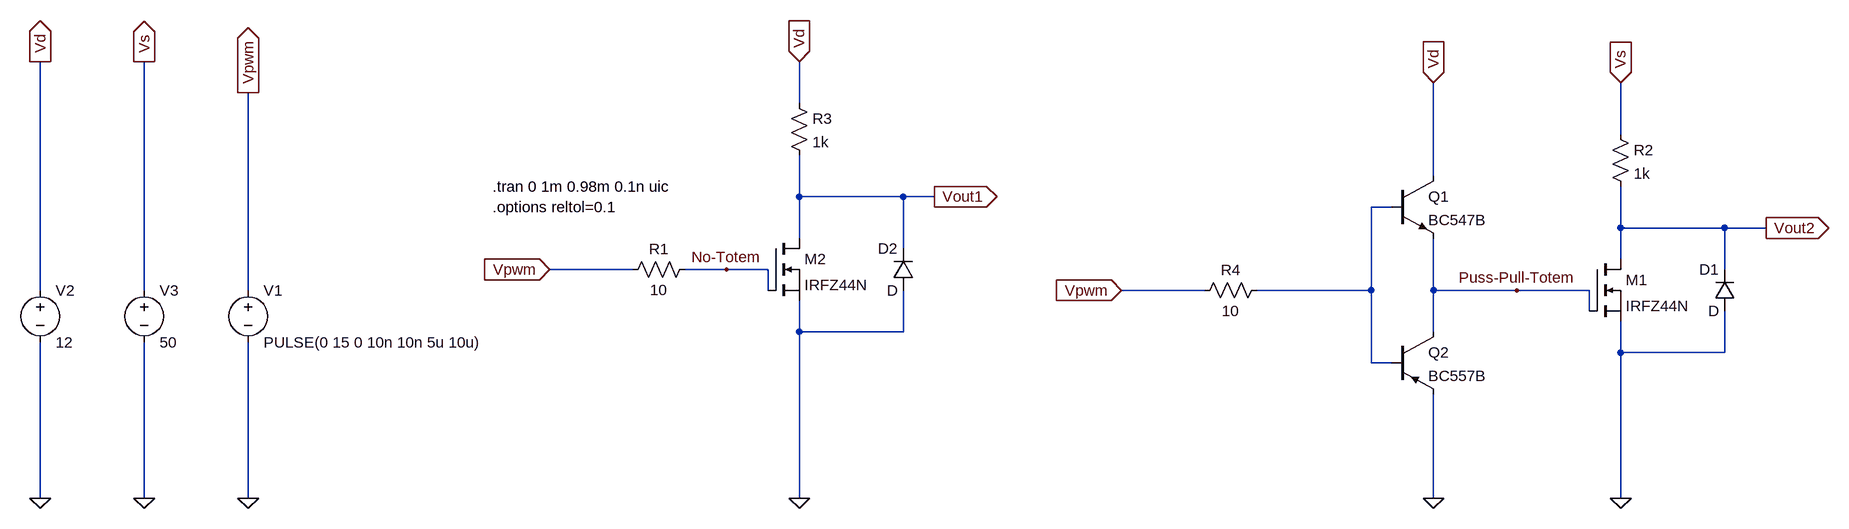
[diagram p0: schematic Task 1.asc]
Task 1.asc, the LTspice schematic file:
Version 4
SHEET 1 2400 680
WIRE 64 -224 64 -288
WIRE 1328 -176 1328 -256
WIRE 1040 -112 1040 -256
WIRE 64 -80 64 -144
WIRE 224 -80 64 -80
WIRE 272 -80 224 -80
WIRE 976 -64 944 -64
WIRE 1328 -32 1328 -96
WIRE 1488 -32 1328 -32
WIRE 1552 -32 1488 -32
WIRE 64 -16 64 -80
WIRE 224 0 224 -80
WIRE 1328 16 1328 -32
WIRE -192 32 -320 32
WIRE -48 32 -112 32
WIRE 16 32 -48 32
WIRE 1488 32 1488 -32
WIRE -1104 64 -1104 -288
WIRE -944 64 -944 -288
WIRE -784 64 -784 -240
WIRE 16 64 16 32
WIRE 688 64 560 64
WIRE 944 64 944 -64
WIRE 944 64 768 64
WIRE 1040 64 1040 -16
WIRE 1168 64 1040 64
WIRE 1280 64 1168 64
WIRE 1280 96 1280 64
WIRE 64 128 64 80
WIRE 224 128 224 64
WIRE 224 128 64 128
WIRE 1040 128 1040 64
WIRE 1328 160 1328 112
WIRE 1488 160 1488 96
WIRE 1488 160 1328 160
WIRE 944 176 944 64
WIRE 976 176 944 176
WIRE -1104 384 -1104 144
WIRE -944 384 -944 144
WIRE -784 384 -784 144
WIRE 64 384 64 128
WIRE 1040 384 1040 224
WIRE 1328 384 1328 160
FLAG -784 384 0
FLAG -1104 384 0
FLAG -944 384 0
FLAG 1040 384 0
FLAG 1328 384 0
FLAG -784 -240 Vpwm
IOPIN -784 -240 Out
FLAG -1104 -288 Vd
IOPIN -1104 -288 Out
FLAG -944 -288 Vs
IOPIN -944 -288 Out
FLAG 1040 -256 Vd
IOPIN 1040 -256 In
FLAG 1328 -256 Vs
IOPIN 1328 -256 In
FLAG 64 -288 Vd
IOPIN 64 -288 In
FLAG 64 384 0
FLAG -320 32 Vpwm
IOPIN -320 32 In
FLAG 1552 -32 Vout2
IOPIN 1552 -32 Out
FLAG 560 64 Vpwm
IOPIN 560 64 In
FLAG 272 -80 Vout1
IOPIN 272 -80 Out
FLAG -48 32 No-Totem
FLAG 1168 64 Puss-Pull-Totem
SYMBOL voltage -784 48 R0
WINDOW 123 0 0 Left 0
WINDOW 39 0 0 Left 0
SYMATTR InstName V1
SYMATTR Value PULSE(0 15 0 10n 10n 5u 10u)
SYMBOL voltage -1104 48 R0
WINDOW 123 0 0 Left 0
WINDOW 39 0 0 Left 0
SYMATTR InstName V2
SYMATTR Value 12
SYMBOL voltage -944 48 R0
WINDOW 123 0 0 Left 0
WINDOW 39 0 0 Left 0
SYMATTR InstName V3
SYMATTR Value 50
SYMBOL npn 976 -112 R0
SYMATTR InstName Q1
SYMATTR Value BC547B
SYMBOL pnp 976 128 R0
SYMATTR InstName Q2
SYMATTR Value BC557B
SYMBOL nmos 1280 16 R0
SYMATTR InstName M1
SYMATTR Value IRFZ44N
SYMBOL res 1312 -192 R0
SYMATTR InstName R2
SYMATTR Value 1k
SYMBOL nmos 16 -16 R0
SYMATTR InstName M2
SYMATTR Value IRFZ44N
SYMBOL res -96 16 R90
WINDOW 0 0 56 VBottom 2
WINDOW 3 32 56 VTop 2
SYMATTR InstName R1
SYMATTR Value 10
SYMBOL res 48 -240 R0
SYMATTR InstName R3
SYMATTR Value 1k
SYMBOL res 784 48 R90
WINDOW 0 0 56 VBottom 2
WINDOW 3 32 56 VTop 2
SYMATTR InstName R4
SYMATTR Value 10
SYMBOL diode 1504 96 R180
WINDOW 0 24 64 Left 2
WINDOW 3 24 0 Left 2
SYMATTR InstName D1
SYMBOL diode 240 64 R180
WINDOW 0 24 64 Left 2
WINDOW 3 24 0 Left 2
SYMATTR InstName D2
TEXT -408 -96 Left 2 !.tran 0 1m 0.98m 0.1n uic
TEXT -408 -64 Left 2 !.options reltol=0.1

The netlist it stands for:
* Task 1.asc
V1 Vpwm 0 PULSE(0 15 0 10n 10n 5u 10u)
V2 Vd 0 12
V3 Vs 0 50
Q1 Vd N001 Puss-Pull-Totem 0 BC547B
Q2 Puss-Pull-Totem N001 0 0 BC557B
M1 Vout2 Puss-Pull-Totem 0 0 IRFZ44N
R2 Vs Vout2 1k
M2 Vout1 No-Totem 0 0 IRFZ44N
R1 No-Totem Vpwm 10
R3 Vd Vout1 1k
R4 N001 Vpwm 10
D1 0 Vout2 D
D2 0 Vout1 D
.model D D
.lib standard.dio
.model NPN NPN
.model PNP PNP
.lib standard.bjt
.model NMOS NMOS
.model PMOS PMOS
.lib standard.mos
.tran 0 1m 0.98m 0.1n uic
.options reltol=0.1
.backanno
.end

* Results of the author's LTspice run, read from the files saved beside the schematic
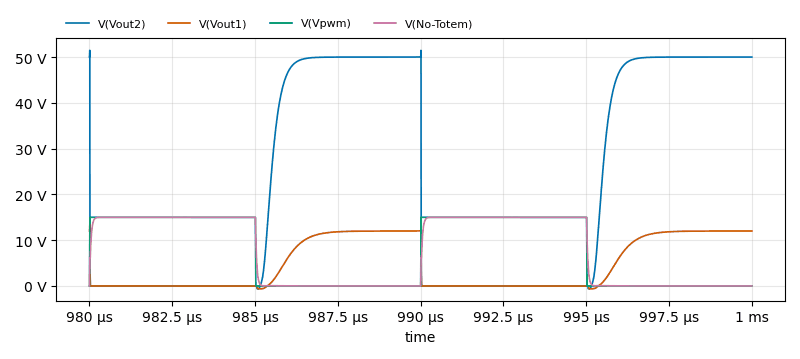
[diagram p1: Transient Analysis of Task 1.asc, plotted from the saved traces]
* Transient Analysis, 1 run:
*   V(Vout2): min -608.7 mV, max 51.46 V, average 22.29 V, rms 32.86 V, last 50 V
*   V(Vout1): min -618.7 mV, max 13.5 V, average 4.725 V, rms 7.29 V, last 12 V
*   V(Vpwm): min 0 V, max 15 V, average 7.515 V, rms 10.61 V, last 0 V
*   V(No-Totem): min 0 V, max 15 V, average 7.515 V, rms 10.57 V, last 0 V